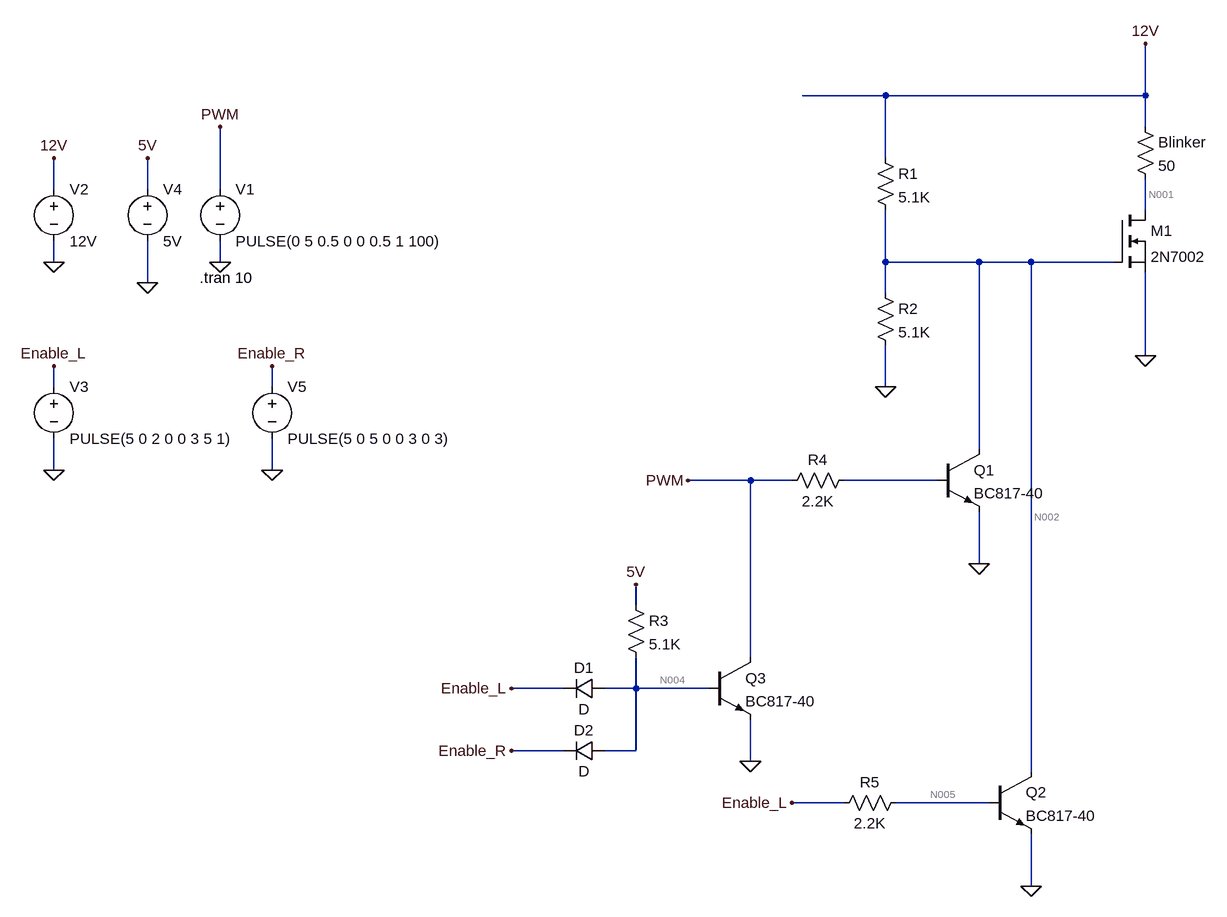
[diagram p0: schematic Blinker.asc]
Blinker.asc, the LTspice schematic file:
Version 4
SHEET 1 880 1172
WIRE -112 -112 -240 -112
WIRE 288 -112 288 -192
WIRE 288 -112 -112 -112
WIRE 288 -64 288 -112
WIRE -112 -16 -112 -112
WIRE -1392 32 -1392 -16
WIRE -1248 32 -1248 -16
WIRE -1136 32 -1136 -64
WIRE 288 64 288 16
WIRE -1392 144 -1392 112
WIRE -1136 144 -1136 112
WIRE -112 144 -112 64
WIRE 32 144 -112 144
WIRE 112 144 32 144
WIRE 240 144 112 144
WIRE -1248 176 -1248 112
WIRE -112 192 -112 144
WIRE 288 288 288 160
WIRE -1392 336 -1392 304
WIRE -1056 336 -1056 304
WIRE -112 336 -112 272
WIRE 32 432 32 144
WIRE -1392 464 -1392 416
WIRE -1056 464 -1056 416
WIRE -320 480 -416 480
WIRE -256 480 -320 480
WIRE -32 480 -176 480
WIRE 32 608 32 528
WIRE -496 672 -496 640
WIRE -320 752 -320 480
WIRE -608 800 -688 800
WIRE -496 800 -496 752
WIRE -496 800 -544 800
WIRE -384 800 -496 800
WIRE -608 896 -688 896
WIRE -496 896 -496 800
WIRE -496 896 -544 896
WIRE -320 912 -320 848
WIRE 112 928 112 144
WIRE -176 976 -256 976
WIRE 48 976 -96 976
WIRE 112 1104 112 1024
FLAG -112 336 0
FLAG 288 -192 12V
FLAG 288 288 0
FLAG 32 608 0
FLAG -1136 144 0
FLAG -1392 144 0
FLAG 112 1104 0
FLAG -1392 464 0
FLAG -1136 -64 PWM
FLAG -688 800 Enable_L
FLAG -320 912 0
FLAG -496 640 5V
FLAG -1248 176 0
FLAG -1248 -16 5V
FLAG -1392 -16 12V
FLAG -416 480 PWM
FLAG -688 896 Enable_R
FLAG -1392 304 Enable_L
FLAG -256 976 Enable_L
FLAG -1056 464 0
FLAG -1056 304 Enable_R
SYMBOL nmos 240 64 R0
SYMATTR InstName M1
SYMATTR Value 2N7002
SYMBOL res -128 -32 R0
SYMATTR InstName R1
SYMATTR Value 5.1K
SYMBOL res -128 176 R0
SYMATTR InstName R2
SYMATTR Value 5.1K
SYMBOL res 272 -80 R0
SYMATTR InstName Blinker
SYMATTR Value 50
SYMBOL npn -32 432 R0
SYMATTR InstName Q1
SYMATTR Value BC817-40
SYMBOL res -160 464 R90
WINDOW 0 0 56 VBottom 2
WINDOW 3 32 56 VTop 2
SYMATTR InstName R4
SYMATTR Value 2.2K
SYMBOL voltage -1136 16 R0
WINDOW 123 0 0 Left 0
WINDOW 39 0 0 Left 0
SYMATTR InstName V1
SYMATTR Value PULSE(0 5 0.5 0 0 0.5 1 100)
SYMBOL voltage -1392 16 R0
WINDOW 123 0 0 Left 0
WINDOW 39 0 0 Left 0
SYMATTR InstName V2
SYMATTR Value 12V
SYMBOL npn 48 928 R0
SYMATTR InstName Q2
SYMATTR Value BC817-40
SYMBOL res -80 960 R90
WINDOW 0 0 56 VBottom 2
WINDOW 3 32 56 VTop 2
SYMATTR InstName R5
SYMATTR Value 2.2K
SYMBOL voltage -1392 320 R0
WINDOW 123 0 0 Left 0
WINDOW 39 0 0 Left 0
SYMATTR InstName V3
SYMATTR Value PULSE(5 0 2 0 0 3 5 1)
SYMBOL npn -384 752 R0
SYMATTR InstName Q3
SYMATTR Value BC817-40
SYMBOL diode -544 784 R90
WINDOW 0 0 32 VBottom 2
WINDOW 3 32 32 VTop 2
SYMATTR InstName D1
SYMBOL res -512 656 R0
SYMATTR InstName R3
SYMATTR Value 5.1K
SYMBOL voltage -1248 16 R0
WINDOW 123 0 0 Left 0
WINDOW 39 0 0 Left 0
SYMATTR InstName V4
SYMATTR Value 5V
SYMBOL diode -544 880 R90
WINDOW 0 0 32 VBottom 2
WINDOW 3 32 32 VTop 2
SYMATTR InstName D2
SYMBOL voltage -1056 320 R0
WINDOW 123 0 0 Left 0
WINDOW 39 0 0 Left 0
SYMATTR InstName V5
SYMATTR Value PULSE(5 0 5 0 0 3 0 3)
TEXT -1168 168 Left 2 !.tran 10

The netlist it stands for:
* Blinker.asc
M1 N001 N002 0 0 2N7002
R1 12V N002 5.1K
R2 N002 0 5.1K
R§Blinker 12V N001 50
Q1 N002 N003 0 0 BC817-40
R4 N003 PWM 2.2K
V1 PWM 0 PULSE(0 5 0.5 0 0 0.5 1 100)
V2 12V 0 12V
Q2 N002 N005 0 0 BC817-40
R5 N005 Enable_L 2.2K
V3 Enable_L 0 PULSE(5 0 2 0 0 3 5 1)
Q3 PWM N004 0 0 BC817-40
D1 N004 Enable_L D
R3 5V N004 5.1K
V4 5V 0 5V
D2 N004 Enable_R D
V5 Enable_R 0 PULSE(5 0 5 0 0 3 0 3)
.model D D
.lib standard.dio
.model NPN NPN
.model PNP PNP
.lib standard.bjt
.model NMOS NMOS
.model PMOS PMOS
.lib standard.mos
.tran 10
.backanno
.end

* Results of the author's LTspice run, read from the files saved beside the schematic
* Operating Point, zero values left out:
*   V(n001) = 12 V
*   V(n002) = 6.043 mV
*   V(12v) = 12 V
*   V(n005) = 703.7 mV
*   V(enable_l) = 5 V
*   V(n004) = 675.4 mV
*   V(5v) = 5 V
*   V(enable_r) = 5 V
*   Ic(Q2) = 2.351 mA
*   Ib(Q2) = 1.953 mA
*   Ie(Q2) = -4.303 mA
*   Ic(Q3) = -1.473 mA
*   Ib(Q3) = 848 µA
*   Ie(Q3) = 624.9 µA
*   Id(M1) = 12.03 pA
*   Is(M1) = -12.03 pA
*   I(D1) = -4.335 pA
*   I(D2) = -4.335 pA
*   I(R1) = 2.352 mA
*   I(R2) = 1.185 µA
*   I(Blinker) = 24.03 pA
*   I(R5) = -1.953 mA
*   I(R3) = 848 µA
*   I(V1) = 1.473 mA
*   I(V2) = -2.352 mA
*   I(V3) = -1.953 mA
*   I(V4) = -848 µA
*   I(V5) = -4.335 pA
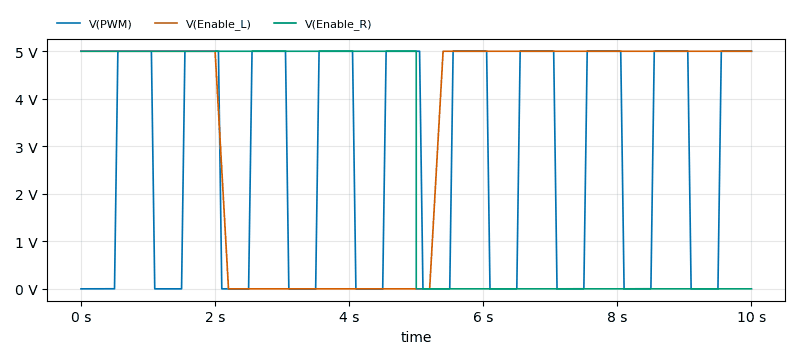
[diagram p1: Transient Analysis of Blinker.asc, plotted from the saved traces]
* Transient Analysis, 1 run:
*   V(PWM): min 0 V, max 5 V, average 2.713 V, rms 3.63 V, last 5 V
*   V(Enable_L): min 0 V, max 5 V, average 3.4 V, rms 4.103 V, last 5 V
*   V(Enable_R): min 0 V, max 5 V, average 2.5 V, rms 3.536 V, last 0 V